# Altium schematic sheet main_pcb.SchDoc
size A2
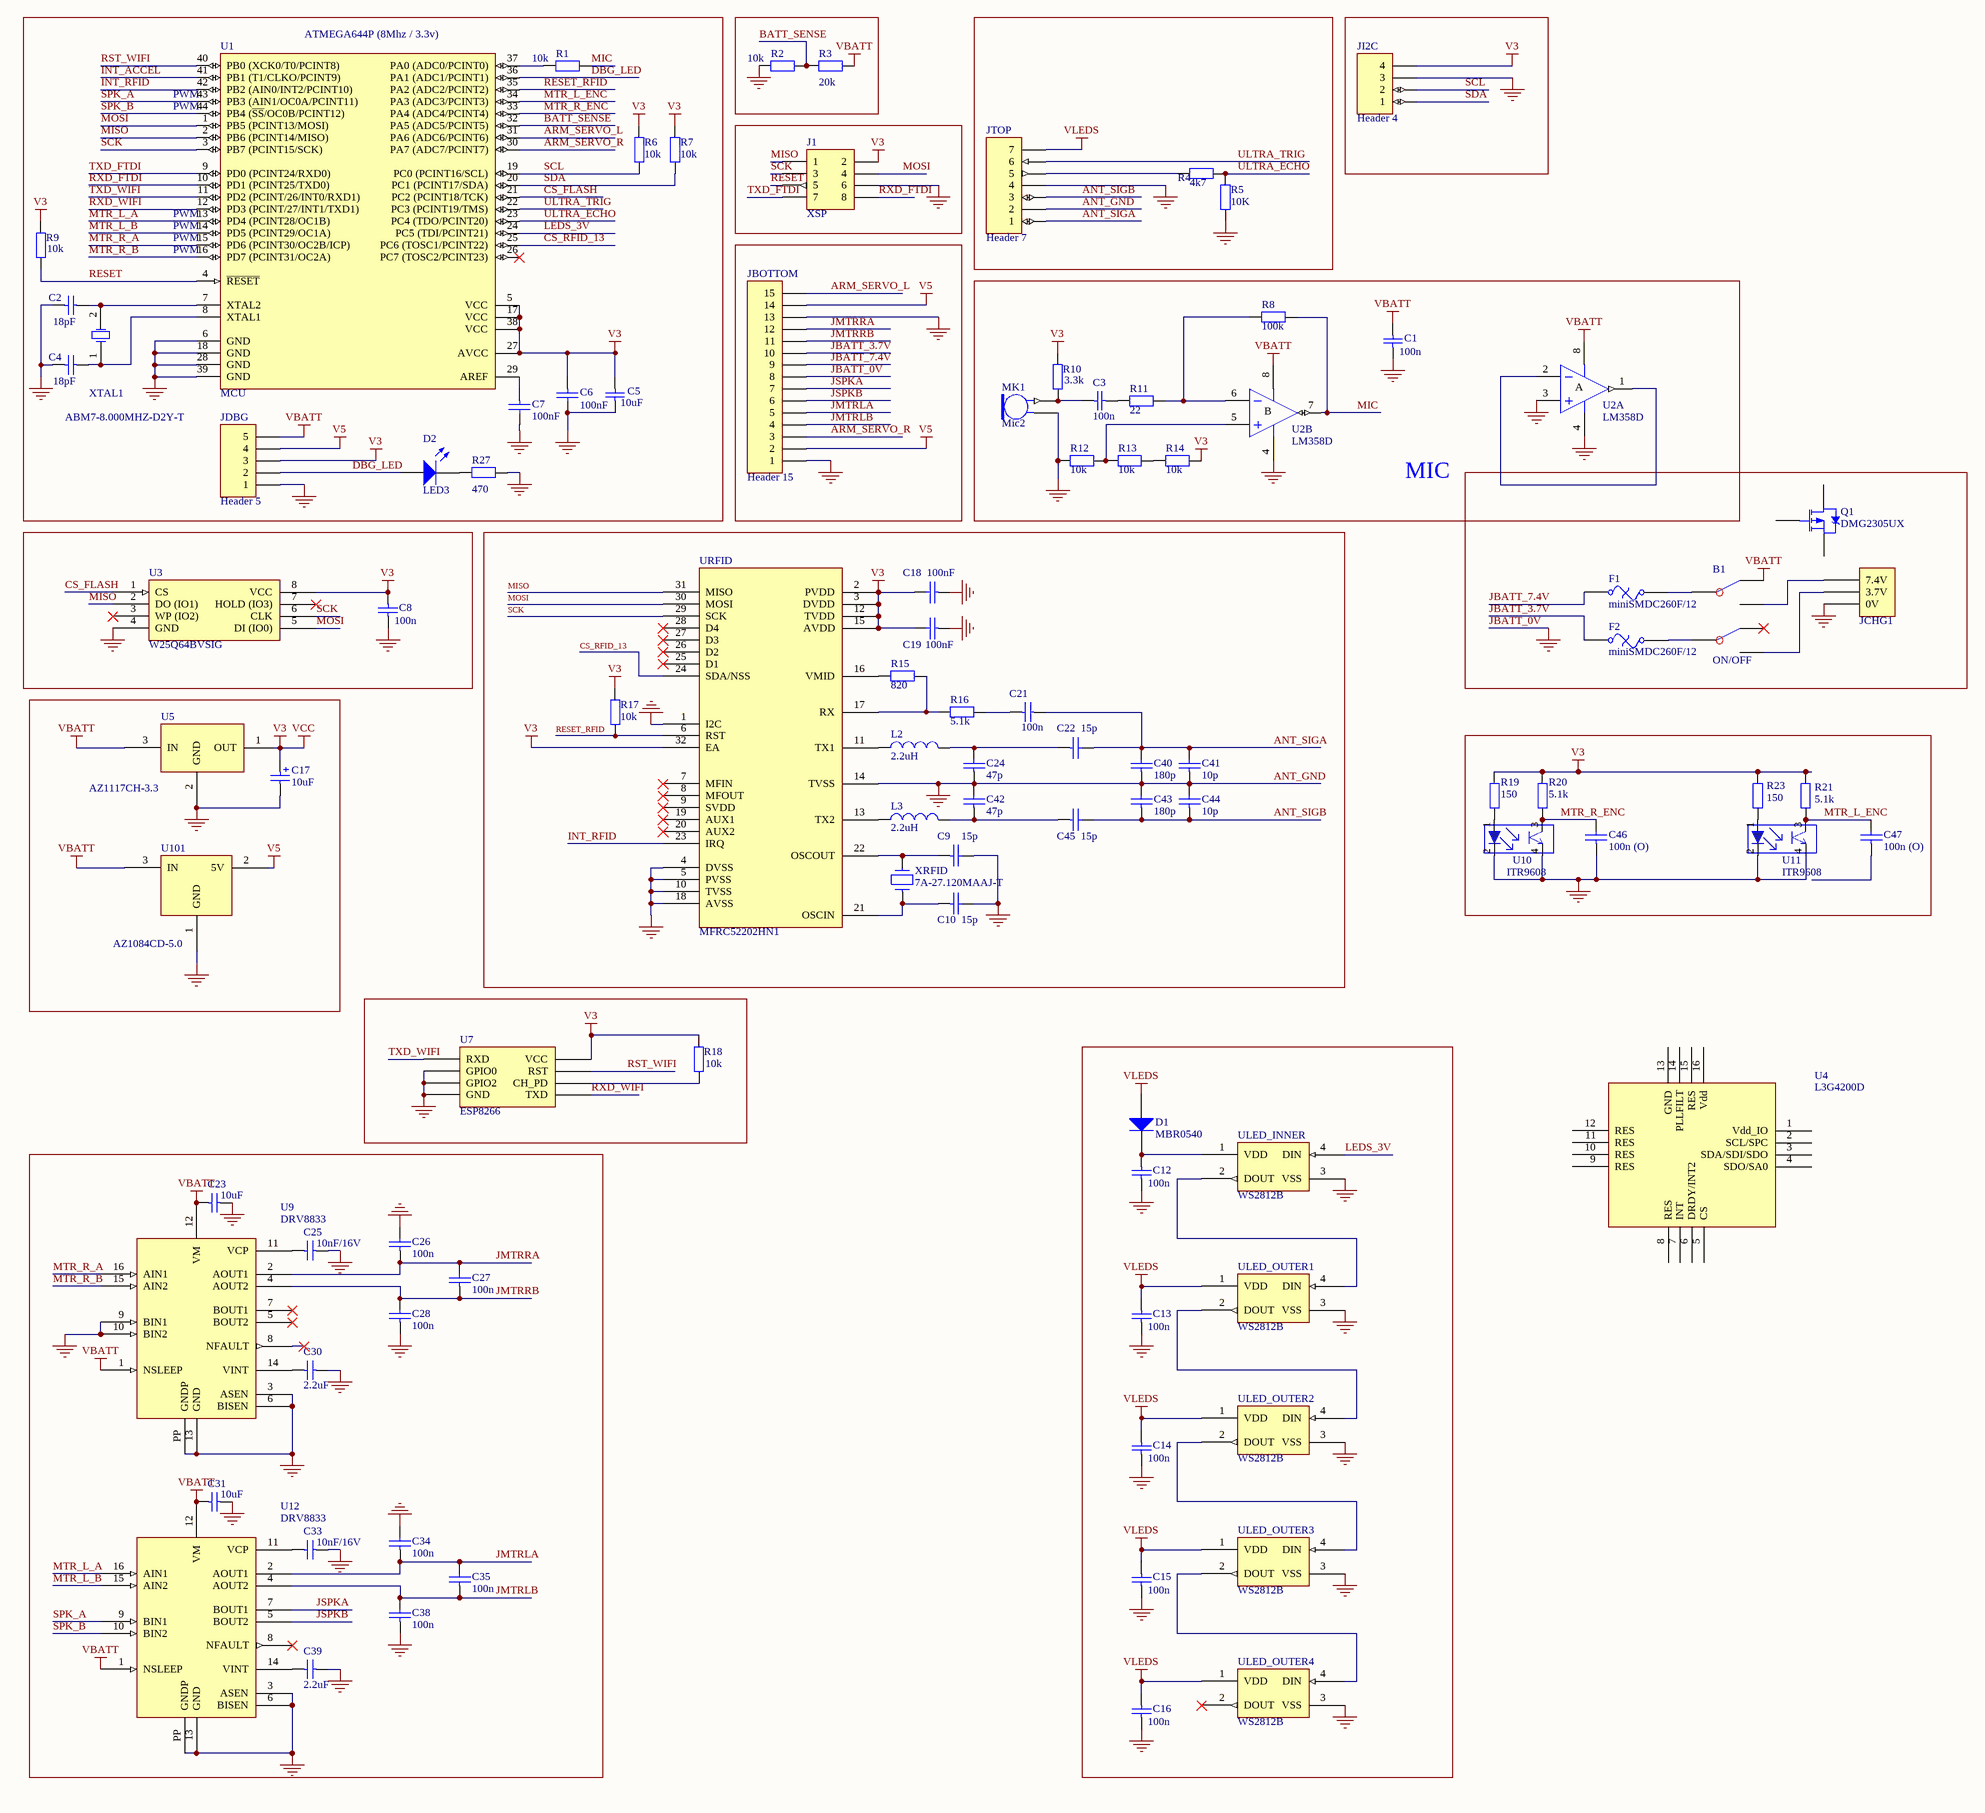
[diagram p0: main_pcb.SchDoc]

## Parts
B1  ON/OFF  [KGPS22F03]
C1  100n  [CAPC1608N]
C2  18pF  [CAPC1608N]
C3  100n  [CAPC1608N]
C4  18pF  [CAPC1608N]
C5  10uF  [CAPC3216L]
C6  100nF  [CAPC1608N]
C7  100nF  [CAPC1608N]
C8  100n  [CAPC1608N]
C9  15p  [CAPC1608N]
C10  15p  [CAPC1608N]
C12  100n  [CAPC1608N]
C13  100n  [CAPC1608N]
C14  100n  [CAPC1608N]
C15  100n  [CAPC1608N]
C16  100n  [CAPC1608N]
C17  10uF  [CAPC2012N]
C18  100nF  [CAPC1608N]
C19  100nF  [CAPC1608N]
C21  100n  [CAPC1608N]
C22  15p  [CAPC1608N]
C23  10uF  [CAPC3216L]
C24  47p  [CAPC1608N]
C25  10nF/16V  [CAPC2012N]
C26  100n  [CAPC1608N]
C27  100n  [CAPC1608N]
C28  100n  [CAPC1608N]
C30  2.2uF  [CAPC2012N]
C31  10uF  [CAPC3216L]
C33  10nF/16V  [CAPC2012N]
C34  100n  [CAPC1608N]
C35  100n  [CAPC1608N]
C38  100n  [CAPC1608N]
C39  2.2uF  [CAPC2012N]
C40  180p  [CAPC1608N]
C41  10p  [CAPC1608N]
C42  47p  [CAPC1608N]
C43  180p  [CAPC1608N]
C44  10p  [CAPC1608N]
C45  15p  [CAPC1608N]
C46  100n (O)  [CAPC1608N]
C47  100n (O)  [CAPC1608N]
D1  MBR0540  [SOD123/X.85]
D2  LED3  [CAPC1608N]
F1  miniSMDC260F/12  [miniSMDC260F/12]
F2  miniSMDC260F/12  [miniSMDC260F/12]
J1  XSP  [HDR2X4H]
JBOTTOM  Header 15  [B15B-XH-A]
JCHG1  Charger  [S3B-XH-A(LF)(SN)]  (value not drawn)
JDBG  Header 5  [HDR1X5]
JI2C  Header 4  [HDR1X4]
JTOP  Header 7  [S7B-XH-A]
L2  2.2uH  [INDC1608N]
L3  2.2uH  [INDC1608N]
MK1  Mic2  [electret_6mm]
Q1  DMG2305UX  [DMG2305UX-13]
R1  10k  [RESC1608N]
R2  10k  [RESC1608N]
R3  20k  [RESC1608N]
R4  value 4k7  [RESC1608N]  (hidden comment: 10k)
R5  10K  [RESC1608N]
R6  10k  [RESC1608N]
R7  10k  [RESC1608N]
R8  100k  [RESC1608N]
R9  10k  [RESC1608N]
R10  3.3k  [RESC1608N]
R11  22  [RESC1608N]
R12  10k  [RESC1608N]
R13  10k  [RESC1608N]
R14  10k  [RESC1608N]
R15  820  [RESC1608N]
R16  5.1k  [RESC1608N]
R17  10k  [RESC1608N]
R18  10k  [RESC1608N]
R19  value 150  [RESC1608N]  (hidden comment: 1K)
R20  value 5.1k  [RESC1608N]
R21  value 5.1k  [RESC1608N]
R23  value 150  [RESC1608N]  (hidden comment: 1K)
R27  470  [RESC1608N]
U1  MCU  [atmega644p]
U2  LM358D  [LM358D]  (parts A,B of 2)
U3  W25Q64BVSIG  [W25Q64BVSIG]
U4  L3G4200D
U5  AZ1117CH-3.3  [SOT223]
U7  ESP8266  [ESP8266]
U9  DRV8833  [DRV8833]
U10  ITR9608  [ITR9608]
U11  ITR9608  [ITR9608]
U12  DRV8833  [DRV8833]
U101  AZ1084CD-5.0  [AZ1084CD-5.0]
ULED_INNER  WS2812B  [WS2812B]
ULED_OUTER1  WS2812B  [WS2812B]
ULED_OUTER2  WS2812B  [WS2812B]
ULED_OUTER3  WS2812B  [WS2812B]
ULED_OUTER4  WS2812B  [WS2812B]
URFID  MFRC52202HN1  [MFRC52202HN1]
XRFID  7A-27.120MAAJ-T  [XTAL]
XTAL1  ABM7-8.000MHZ-D2Y-T  [XTAL]

## Blocks framed on the sheet
MIC: C1 C3 MK1 R8 R10-R14 U2

## Nets
ANT_GND: C1.2 C2.1 C4.1 C5.1 C6.2 C7.2 C8.2 C9.2 C10.2 C12.2 C13.2 C14.2 C15.2 C16.2 C17.2 C18.1 C19.1 C23.1 C24.1 C25.1 C26.2 C28.1 C30.1 C31.1 C33.1 C34.2 C38.1 C39.1 C40.1 C41.1 C42.2 C43.2 C44.2 C46.1 J1.6 JBOTTOM.1 JBOTTOM.8 JBOTTOM.13 JCHG1.1(0V) JDBG.1 JI2C.3 JTOP.2 JTOP.4 MK1.2 R2.1 R5.2 R12.1 R27.2 U1.6(GND) U1.18(GND) U1.28(GND) U1.39(GND) U2.3(IN+) U2.4(V-) U3.4(GND) U5.2(GND) U7.GND U7.GPIO0 U7.GPIO2 U9.3(ASEN) U9.6(BISEN) U9.9(BIN1) U9.10(BIN2) U9.13(GND) U9.PP(GNDP) U10.2(CATHODE) U10.4(ENITIER) U11.2(CATHODE) U11.4(ENITIER) U12.3(ASEN) U12.6(BISEN) U12.13(GND) U12.PP(GNDP) U101.1(GND) ULED_INNER.3(VSS) ULED_OUTER1.3(VSS) ULED_OUTER2.3(VSS) ULED_OUTER3.3(VSS) ULED_OUTER4.3(VSS) URFID.1(I2C) URFID.4(DVSS) URFID.5(PVSS) URFID.10(TVSS) URFID.14(TVSS) URFID.18(AVSS)  [also labelled GND, JBATT_0V]
V3: C5.2 C6.1 C8.1 C17.1 C18.2 C19.2 J1.2 JDBG.3 JI2C.4 R6.2 R7.2 R9.1 R10.1 R14.2 R17.1 R18.1 R19.2 R20.2 R21.2 R23.2 U1.5(VCC) U1.17(VCC) U1.27(AVCC) U1.38(VCC) U3.8(VCC) U5.1(OUT) U7.VCC URFID.2(PVDD) URFID.3(DVDD) URFID.12(TVDD) URFID.15(AVDD) URFID.32(EA)  [also labelled VCC]
V5: JBOTTOM.2 JBOTTOM.14 JDBG.4 U101.2(5V)
VBATT: B1.3 C1.1 C23.2 C31.2 JDBG.5 R3.2 U2.8(V+) U5.3(IN) U9.1(NSLEEP) U9.12(VM) U12.1(NSLEEP) U12.12(VM) U101.3(IN)
VLEDS: C13.1 C14.1 C15.1 C16.1 D1.2(A) JTOP.7 ULED_OUTER1.1(VDD) ULED_OUTER2.1(VDD) ULED_OUTER3.1(VDD) ULED_OUTER4.1(VDD)
ANT_SIGA: C21.2 C22.2 C40.2 C41.2 JTOP.1
ANT_SIGB: C43.1 C44.1 C45.2 JTOP.3
ARM_SERVO_L: JBOTTOM.15 U1.31(PA6_(ADC6/PCINT6))
ARM_SERVO_R: JBOTTOM.3 U1.30(PA7_(ADC7/PCINT7))
BATT_SENSE: R2.2 R3.1 U1.32(PA5_(ADC5/PCINT5))
CS_FLASH: U1.21(PC2_(PCINT18/TCK)) U3.1(CS)
CS_RFID_13: U1.25(PC6_(TOSC1/PCINT22)) URFID.24(SDA/NSS)
DBG_LED: D2.1(A) JDBG.2 U1.36(PA1_(ADC1/PCINT1))
INT_ACCEL: U1.41(PB1_(T1/CLKO/PCINT9))
INT_RFID: U1.42(PB2_(AIN0/INT2/PCINT10)) URFID.23(IRQ)
JBATT_3.7V: F2.1 JBOTTOM.10
JBATT_7.4V: F1.1 JBOTTOM.9
JMTRLA: C34.1 C35.2 JBOTTOM.5 U12.2(AOUT1)
JMTRLB: C35.1 C38.2 JBOTTOM.4 U12.4(AOUT2)
JMTRRA: C26.1 C27.2 JBOTTOM.12 U9.2(AOUT1)
JMTRRB: C27.1 C28.2 JBOTTOM.11 U9.4(AOUT2)
JSPKA: JBOTTOM.7 U12.7(BOUT1)
JSPKB: JBOTTOM.6 U12.5(BOUT2)
LEDS_3V: U1.24(PC5_(TDI/PCINT21)) ULED_INNER.4(DIN)
MIC: R1.2 R8.2 U2.7(OUT)
MISO: J1.1 U1.2(PB6_(PCINT14/MISO)) U3.2(DO_(IO1)) URFID.31(MISO)
MOSI: J1.4 U1.1(PB5_(PCINT13/MOSI)) U3.5(DI_(IO0)) URFID.30(MOSI)
MTR_L_A: U1.13(PD4_(PCINT28/OC1B)) U12.16(AIN1)
MTR_L_B: U1.14(PD5_(PCINT29/OC1A)) U12.15(AIN2)
MTR_L_ENC: C47.2 R21.1 U1.34(PA3_(ADC3/PCINT3)) U11.3(COLLECTOR)
MTR_R_A: U1.15(PD6_(PCINT30/OC2B/ICP)) U9.16(AIN1)
MTR_R_B: U1.16(PD7_(PCINT31/OC2A)) U9.15(AIN2)
MTR_R_ENC: C46.2 R20.1 U1.33(PA4_(ADC4/PCINT4)) U10.3(COLLECTOR)
RESET: J1.5 R9.2 U1.4(~{RESET})
RESET_RFID: R17.2 U1.35(PA2_(ADC2/PCINT2)) URFID.6(RST)
RST_WIFI: U1.40(PB0_(XCK0/T0/PCINT8)) U7.RST
RXD_FTDI: J1.8 U1.10(PD1_(PCINT25/TXD0))
RXD_WIFI: U1.12(PD3_(PCINT/27/INT1/TXD1)) U7.TXD
SCK: J1.3 U1.3(PB7_(PCINT15/SCK)) U3.6(CLK) URFID.29(SCK)
SCL: JI2C.2 R6.1 U1.19(PC0_(PCINT16/SCL))
SDA: JI2C.1 R7.1 U1.20(PC1_(PCINT17/SDA))
SPK_A: U1.43(PB3_(AIN1/OC0A/PCINT11)) U12.9(BIN1)
SPK_B: U1.44(PB4_(~{SS}/OC0B/PCINT12)) U12.10(BIN2)
TXD_FTDI: J1.7 U1.9(PD0_(PCINT24/RXD0))
TXD_WIFI: U1.11(PD2_(PCINT/26/INT0/RXD1)) U7.RXD
ULTRA_ECHO: R4.1 R5.1 U1.23(PC4_(TDO/PCINT20))
ULTRA_TRIG: JTOP.6 U1.22(PC3_(PCINT19/TMS))
NetB1_1: B1.1 JCHG1.3(7.4V)
NetB1_2: B1.2 F1.2
NetB1_5: B1.5 F2.2
NetB1_6: B1.6 JCHG1.2(3.7V)
NetC2_2: C2.2 U1.7(XTAL2) XTAL1.2(OSC2)
NetC3_1: C3.1 R11.1
NetC3_2: C3.2 MK1.1 R10.2
NetC4_2: C4.2 U1.8(XTAL1) XTAL1.1(OSC1)
NetC7_1: C7.1 U1.29(AREF)
NetC9_1: C9.1 URFID.22(OSCOUT) XRFID.2
NetC10_1: C10.1 URFID.21(OSCIN) XRFID.1
NetC12_1: C12.1 D1.1(K) ULED_INNER.1(VDD)
NetC21_1: C21.1 R16.1
NetC22_1: C22.1 C24.2 L2.2
NetC25_2: C25.2 U9.11(VCP)
NetC30_2: C30.2 U9.14(VINT)
NetC33_2: C33.2 U12.11(VCP)
NetC39_2: C39.2 U12.14(VINT)
NetC42_1: C42.1 C45.1 L3.2
NetD2_2: D2.2(K) R27.1
NetJTOP_5: JTOP.5 R4.2
NetL2_1: L2.1 URFID.11(TX1)
NetL3_1: L3.1 URFID.13(TX2)
NetR1_1: R1.1 U1.37(PA0_(ADC0/PCINT0))
NetR8_1: R8.1 R11.2 U2.6(IN-)
NetR12_2: R12.2 R13.1 U2.5(IN+)
NetR13_2: R13.2 R14.1
NetR15_1: R15.1 R16.2 URFID.17(RX)
NetR15_2: R15.2 URFID.16(VMID)
NetR18_2: R18.2 U7.CH_PD
NetR19_1: R19.1 U10.1(ANODE)
NetR23_1: R23.1 U11.1(ANODE)
NetU2_1: U2.1(OUT) U2.2(IN-)
NetULED_INNER_2: ULED_INNER.2(DOUT) ULED_OUTER1.4(DIN)
NetULED_OUTER1_2: ULED_OUTER1.2(DOUT) ULED_OUTER2.4(DIN)
NetULED_OUTER2_2: ULED_OUTER2.2(DOUT) ULED_OUTER3.4(DIN)
NetULED_OUTER3_2: ULED_OUTER3.2(DOUT) ULED_OUTER4.4(DIN)

Not connected (* = marked no-connect by the designer): B1 4*; C47 1; Q1 D G S; U1 26(PC7_(TOSC2/PCINT23))*; U3 3(WP_(IO2))* 7(HOLD_(IO3))*; U4 1(Vdd_IO) 2(SCL/SPC) 3(SDA/SDI/SDO) 4(SDO/SA0) 5(CS) 6(DRDY/INT2) 7(INT) 8(RES) 9(RES) 10(RES) 11(RES) 12(RES) 13(GND) 14(PLLFILT) 15(RES) 16(Vdd); U9 5(BOUT2)* 7(BOUT1)* 8(NFAULT)*; U12 8(NFAULT)*; ULED_OUTER4 2(DOUT)*; URFID 7(MFIN)* 8(MFOUT)* 9(SVDD)* 19(AUX1)* 20(AUX2)* 25(D1)* 26(D2)* 27(D3)* 28(D4)*

## Notes on the sheet
- (near U1) ATMEGA644P (8Mhz / 3.3v)
- (near U1) PWM
- (in symbol LM358D, part A) A
- (in symbol LM358D, part B) B

## Library data of the parts
B1 = Component_1
C1-C5 C8 C12-C16 C21 C23 C25 C30 C31 C33 C39 = Cap: Capacitor; Published: 8-Jun-2000; LatestRevisionDate: 17-Jul-2002; LatestRevisionNote: Re-released for DXP Platform.; PackageReference: RAD-0.3; Publisher: Altium Limited
  C1 C3 C8 C12-C16 C21: PackageDescription: Radial Cap, Thru-Hole; 2 Leads; 0.3 in Pin Spacing; Value: 100n
  C2 C4: Value: 18pF
  C5 C23 C31: PackageDescription: Radial Cap, Thru-Hole; 2 Leads; 0.3 in Pin Spacing; Value: 10uF
  C25 C33: PackageDescription: Radial Cap, Thru-Hole; 2 Leads; 0.3 in Pin Spacing; Value: 10nF/16V
  C30 C39: PackageDescription: Radial Cap, Thru-Hole; 2 Leads; 0.3 in Pin Spacing; Value: 2.2uF
C6 C7 C9 C10 C18 C19 C22 C24 C26-C28 C34 C35 C38 C40-C47 = CAP: Capacitor
C17 = Cap Pol2: Polarized Capacitor (Axial); Published: 8-Jun-2000; LatestRevisionDate: 17-Jul-2002; LatestRevisionNote: Re-released for DXP Platform.; PackageReference: POLAR0.8; Publisher: Altium Limited; Value: 10uF
D1 = Diode: Default Diode; Published: 8-Jun-2000; LatestRevisionDate: 17-Jul-2002; LatestRevisionNote: Re-released for DXP Platform.; PackageVersion: Sep-1996; PackageReference: SMC; Publisher: Altium Limited; Code_JEDEC: DO-214-AB
D2 = LED3: Typical BLUE SiC LED; Published: 8-Jun-2000; LatestRevisionDate: 17-Dec-2003; LatestRevisionNote: PCB Footprint replaced.; DatasheetVersion: 16-Apr-2002; PackageVersion: 16-Apr-2002; PackageReference: 3.5X2.8X1.9; Publisher: Altium Limited
F1 F2 = Fuse Thermal: Thermal Fuse; Published: 24-Mar-1999; LatestRevisionDate: 17-Jul-2002; LatestRevisionNote: Re-released for DXP Platform.; PackageReference: PIN-W2/E2.8; Publisher: Altium Limited
J1 = Header 4X2H: Header, 4-Pin, Dual row, Right Angle; LatestRevisionDate: 17-Jul-2002; LatestRevisionNote: Re-released for DXP Platform.; Publisher: Altium Limited
JBOTTOM = Header 15: Header, 15-Pin; LatestRevisionDate: 17-Jul-2002; LatestRevisionNote: Re-released for DXP Platform.; Publisher: Altium Limited
JCHG1 = BATTCON
JDBG = Header 5: Header, 5-Pin; LatestRevisionDate: 17-Jul-2002; LatestRevisionNote: Re-released for DXP Platform.; Publisher: Altium Limited
JI2C = Header 4: Header, 4-Pin; LatestRevisionDate: 17-Jul-2002; LatestRevisionNote: Re-released for DXP Platform.; Publisher: Altium Limited
JTOP = Header 7: Header, 7-Pin; LatestRevisionDate: 17-Jul-2002; LatestRevisionNote: Re-released for DXP Platform.; Publisher: Altium Limited
L2 L3 = Inductor: Code_IEC: 1005; Published: 8-Jun-2000; LatestRevisionDate: 29-May-2009; LatestRevisionNote: IPC-7351 Footprint Added.; PackageReference: 0402-A; Publisher: Altium Limited; PackageDescription: Chip Inductor; Code_JEITA: 0402; Value: 2.2uH
MK1 = Mic2: Microphone; Published: *; LatestRevisionDate: *; LatestRevisionNote: *; PackageReference: *; Publisher: *
R1-R4 R6-R21 R23 R27 = Res2: Resistor; Published: 8-Jun-2000; LatestRevisionDate: 17-Jul-2002; LatestRevisionNote: Re-released for DXP Platform.; PackageReference: AXIAL-0.4; Publisher: Altium Limited
  R1 R2 R6 R7 R9 R12-R14 R17 R18: Value: 10k
  R3: Value: 20k
  R8: Value: 100k
  R10: Value: 3.3k
  R11: Value: 22
  R15: Value: 820
  R16: Value: 5.1k
  R27: Value: 470
R5 = Res2: Resistor; Value: 20k; Published: 8-Jun-2000; LatestRevisionDate: 17-Jul-2002; LatestRevisionNote: Re-released for DXP Platform.; PackageReference: AXIAL-0.4; Publisher: Altium Limited
U1 = ATmega644-20AU: 8-bit AVR Microcontroller, 2.7-5.5V, 20MHz, 64KB Flash, 2KB EEPROM, 4KB SRAM, 44-pin TQFP; DatasheetVersion: revN, Jul-2010; PackageVersion: revC, Oct-2010; PackageReference: 44A; PackageDescription: 44-Pin Plastic Thin Profile Quad Flat Pack, 10 x 10 x 1.0 mm Body, 0.8 mm Pitch (TQFP); Code_JEDEC: MS-026-ACB; ComponentLink1Description: Manufacturer URL; ComponentLink1URL: http://www.atmel.com/; ComponentLink2Description: ATmega644 Datasheet; ComponentLink2URL: http://www.atmel.com/dyn/resources/prod_documents/doc2593.pdf; ComponentLink3Description: ATmega644 Summary; ComponentLink3URL: http://www.atmel.com/dyn/resources/prod_documents/2593S.pdf
U2 = LM358D: Dual Operational Amplifier; Published: 16-Jan-2001; LatestRevisionDate: 13-Apr-2006; LatestRevisionNote: IPC-7351 Footprint Added.; DatasheetVersion: Jul-1998; PackageVersion: Jan-1998; PackageReference: D008; Publisher: Altium Limited; PackageDescription: 8-Pin Small Outline Integrated Circuit 1.27 mm Pitch; Code_IPC: SOIC127P600-8; ComponentLink1Description: Manufacturer Link; ComponentLink1URL: http://www.ti.com/; ComponentLink2Description: Datasheet; ComponentLink2URL: http://www-s.ti.com/sc/ds/lm358.pdf
U5 = LM1117
XRFID = Tm08B.S01_12M_42